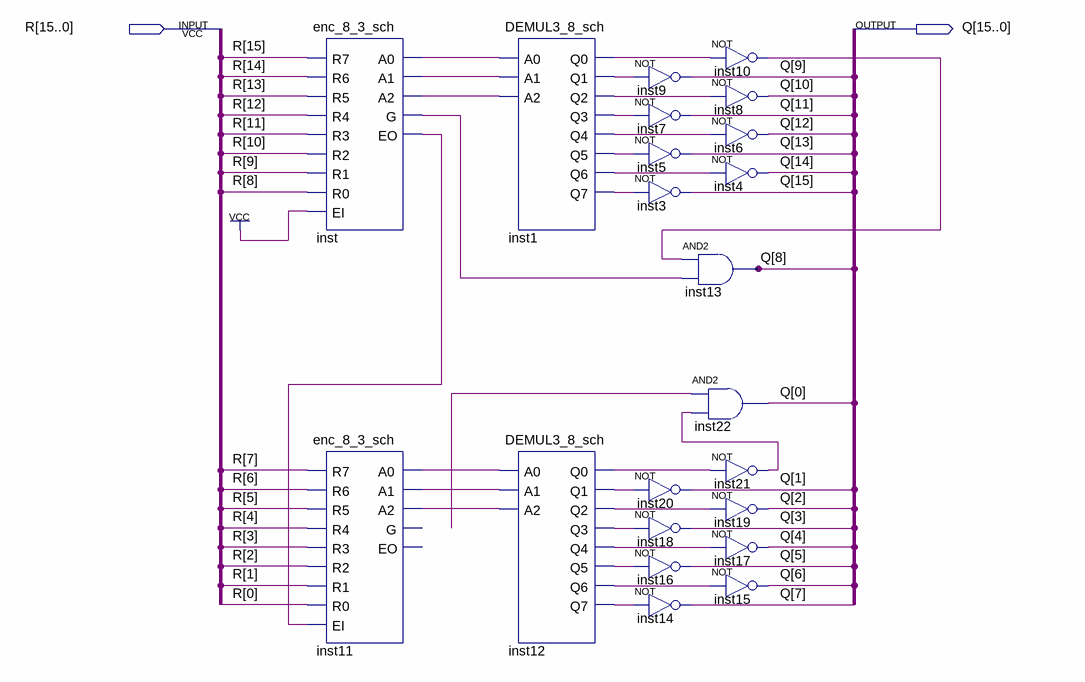
[diagram p0: schematic sheet]
// Quartus schematic Vector8_8.bdf as structural Verilog: 22 symbols, 2 pins
module Vector8_8 (
  input  [15:0] R,
  output [15:0] Q
);

  wire inst1_q0, inst1_q1, inst1_q2, inst1_q3, inst1_q4, inst1_q5, inst1_q6, inst1_q7, inst10_out, inst11_a0,
       inst11_a1, inst11_a2, inst12_q0, inst12_q1, inst12_q2, inst12_q3, inst12_q4, inst12_q5, inst12_q6,
       inst12_q7, inst21_out, inst_a0, inst_a1, inst_a2, inst_eo, inst_g, undriven;

  enc_8_3_sch inst (
    .R7(R[15]), .R6(R[14]), .R5(R[13]), .R4(R[12]), .R3(R[11]), .R2(R[10]), .R1(R[9]), .R0(R[8]), .EI(1'b1),
    .A0(inst_a0), .A1(inst_a1), .A2(inst_a2), .G(inst_g), .EO(inst_eo));
  enc_8_3_sch inst11 (
    .R7(R[7]), .R6(R[6]), .R5(R[5]), .R4(R[4]), .R3(R[3]), .R2(R[2]), .R1(R[1]), .R0(R[0]), .EI(inst_eo),
    .A0(inst11_a0), .A1(inst11_a1), .A2(inst11_a2));  // open: G, EO
  DEMUL3_8_sch inst1 (
    .A0(inst_a0), .A1(inst_a1), .A2(inst_a2), .Q0(inst1_q0), .Q1(inst1_q1), .Q2(inst1_q2), .Q3(inst1_q3),
    .Q4(inst1_q4), .Q5(inst1_q5), .Q6(inst1_q6), .Q7(inst1_q7));
  DEMUL3_8_sch inst12 (
    .A0(inst11_a0), .A1(inst11_a1), .A2(inst11_a2), .Q0(inst12_q0), .Q1(inst12_q1), .Q2(inst12_q2),
    .Q3(inst12_q3), .Q4(inst12_q4), .Q5(inst12_q5), .Q6(inst12_q6), .Q7(inst12_q7));
  not inst9 (Q[9], inst1_q1);
  not inst7 (Q[11], inst1_q3);
  not inst5 (Q[13], inst1_q5);
  not inst3 (Q[15], inst1_q7);
  not inst20 (Q[1], inst12_q1);
  not inst18 (Q[3], inst12_q3);
  not inst16 (Q[5], inst12_q5);
  not inst14 (Q[7], inst12_q7);
  not inst10 (inst10_out, inst1_q0);
  not inst8 (Q[10], inst1_q2);
  not inst6 (Q[12], inst1_q4);
  not inst4 (Q[14], inst1_q6);
  and inst13 (Q[8], inst10_out, inst_g);
  and inst22 (Q[0], undriven, inst21_out);
  not inst21 (inst21_out, inst12_q0);
  not inst19 (Q[2], inst12_q2);
  not inst17 (Q[4], inst12_q4);
  not inst15 (Q[6], inst12_q6);
endmodule
